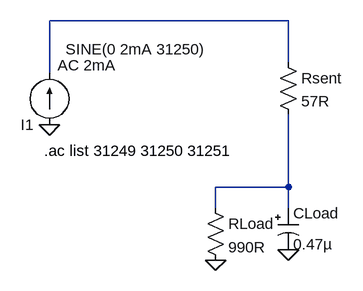
[diagram p0: schematic Simu_Z_LTSpice_R_paral_C_freq_31250Hz.asc]
Simu_Z_LTSpice_R_paral_C_freq_31250Hz.asc, the LTspice schematic file:
Version 4
SHEET 1 1208 680
WIRE 144 32 -224 32
WIRE 144 96 144 32
WIRE -224 112 -224 32
WIRE 144 288 144 176
WIRE 144 288 32 288
WIRE 32 320 32 288
WIRE 144 320 144 288
FLAG 144 384 0
FLAG -224 192 0
FLAG 32 400 0
SYMBOL res 128 80 R0
SYMATTR InstName Rsent
SYMATTR Value 57R
SYMBOL polcap 128 320 R0
WINDOW 3 24 56 Left 2
SYMATTR Value 0.47µ
SYMATTR InstName CLoad
SYMATTR Description Capacitor
SYMATTR Type cap
SYMATTR SpiceLine V=50 Irms=0 Rser=0 Lser=0
SYMBOL res 16 304 R0
SYMATTR InstName RLoad
SYMATTR Value 990R
SYMBOL current -224 192 R180
WINDOW 3 -241 116 Left 2
WINDOW 123 -102 92 Left 2
WINDOW 39 0 0 Left 0
SYMATTR Value SINE(0 2mA 31250)
SYMATTR Value2 AC 2mA
SYMATTR InstName I1
TEXT -232 232 Left 2 !.ac list 31249 31250 31251

The netlist it stands for:
* Simu_Z_LTSpice_R_paral_C_freq_31250Hz.asc
Rsent N001 N002 57R
CLoad N002 0 0.47µ V=50 Irms=0 Rser=0 Lser=0
RLoad N002 0 990R
I1 0 N001 SINE(0 2mA 31250) AC 2mA
.ac list 31249 31250 31251
.backanno
.end